# Altium project Volta-Inteface.PrjPcb
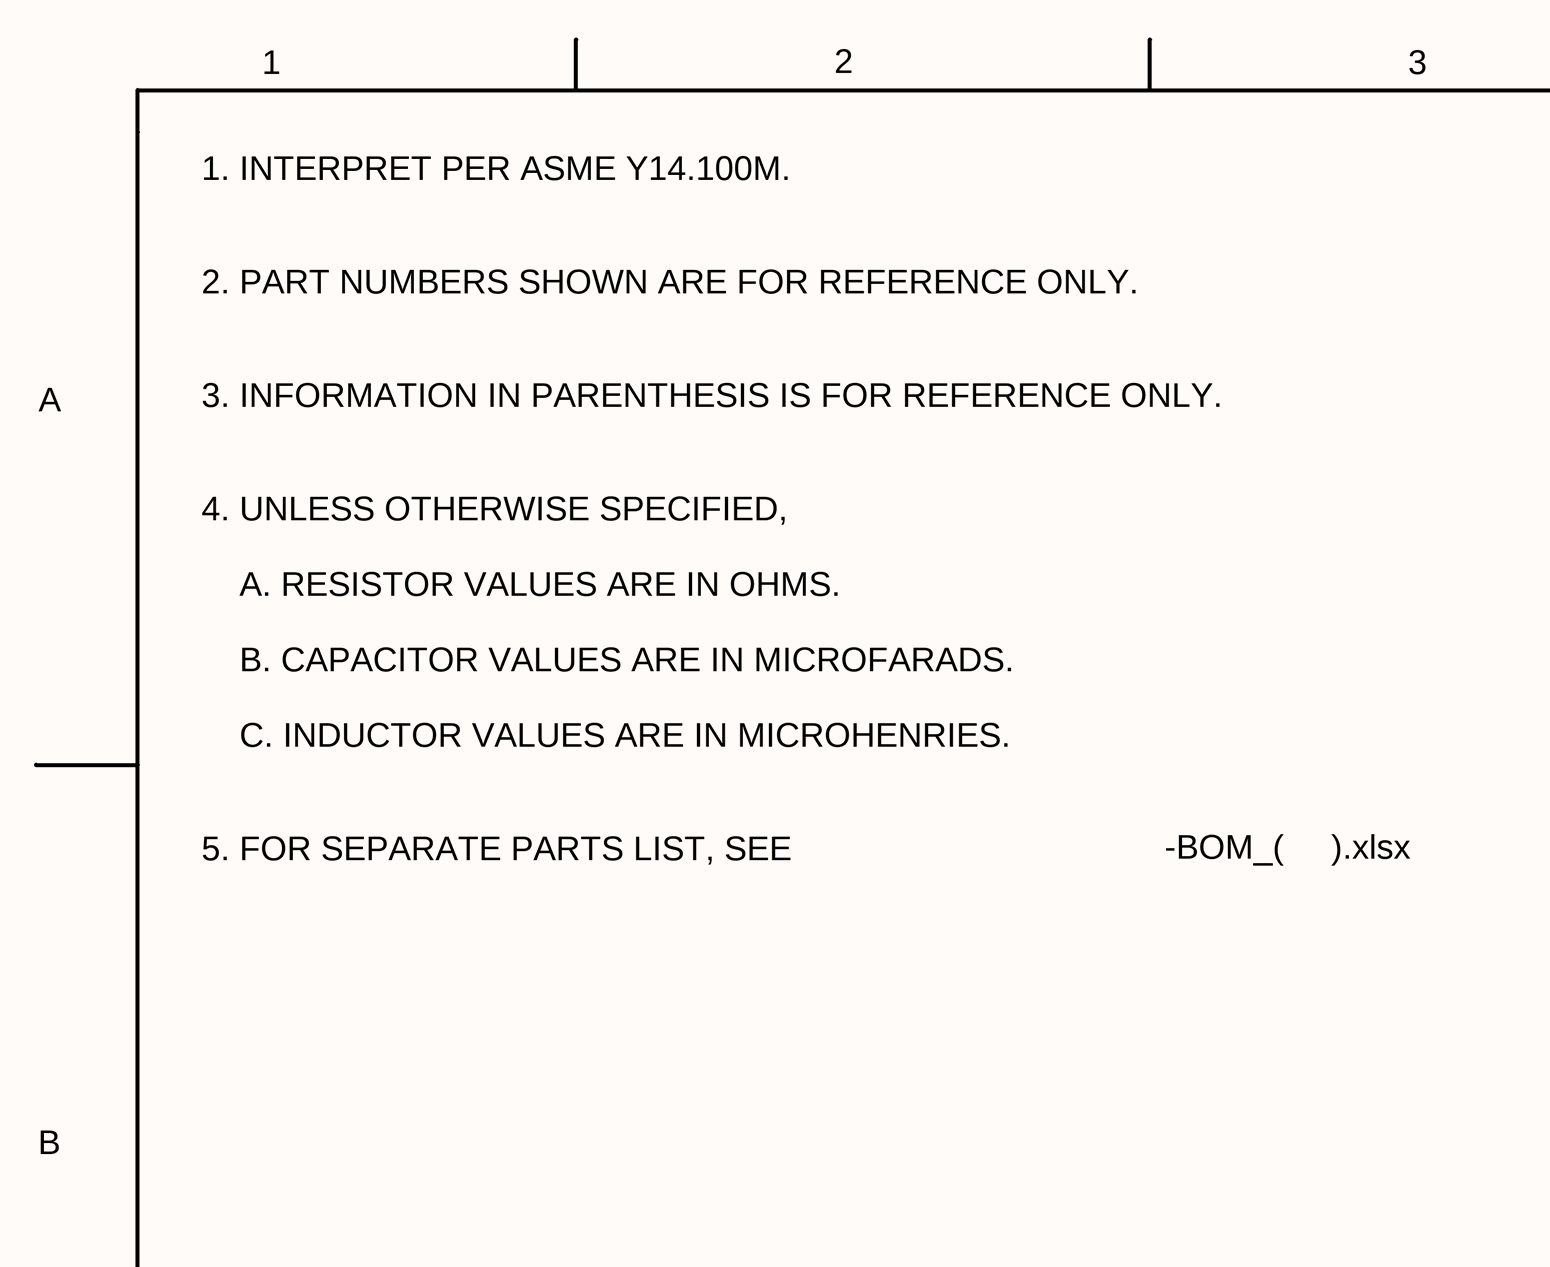
[diagram p0: Volta-Interface-SCH_SH1_(02).SchDoc, top left]
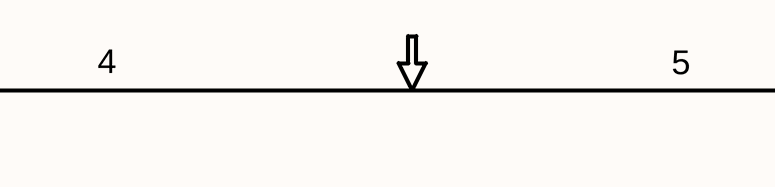
[diagram p1: Volta-Interface-SCH_SH1_(02).SchDoc, top middle]
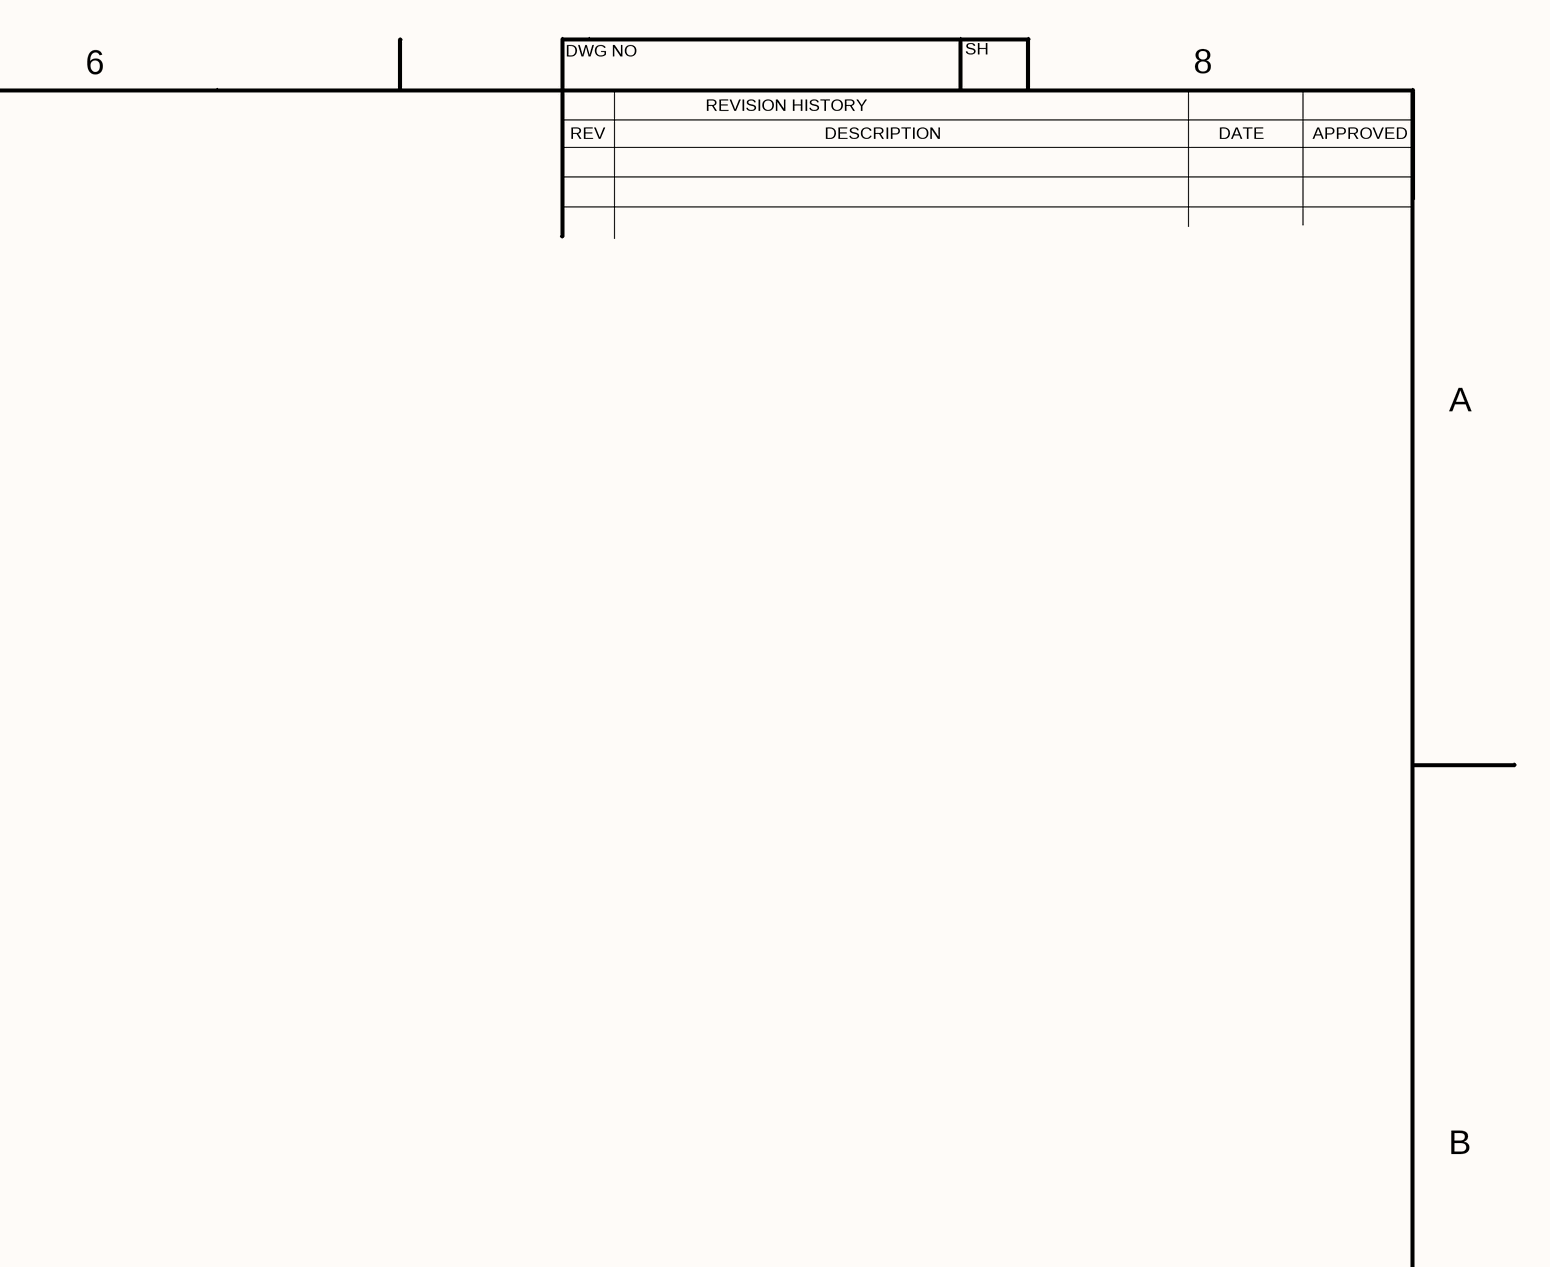
[diagram p2: Volta-Interface-SCH_SH1_(02).SchDoc, top right]
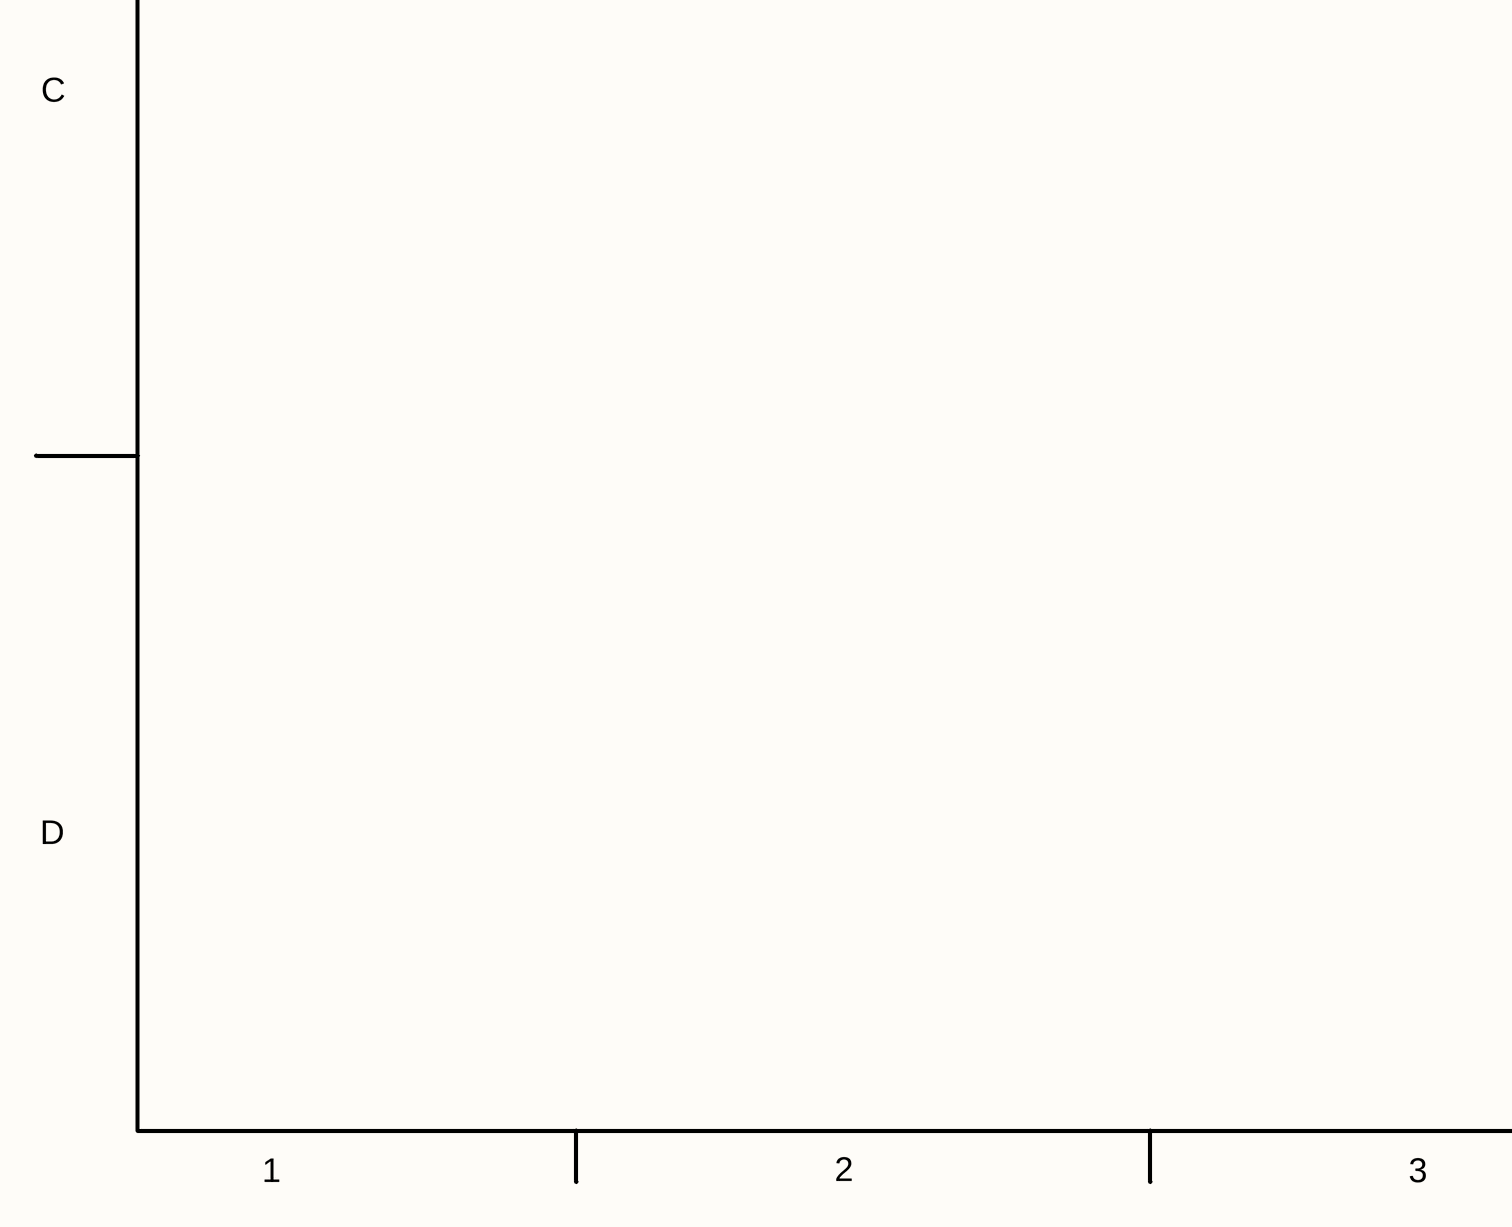
[diagram p3: Volta-Interface-SCH_SH1_(02).SchDoc, bottom left]
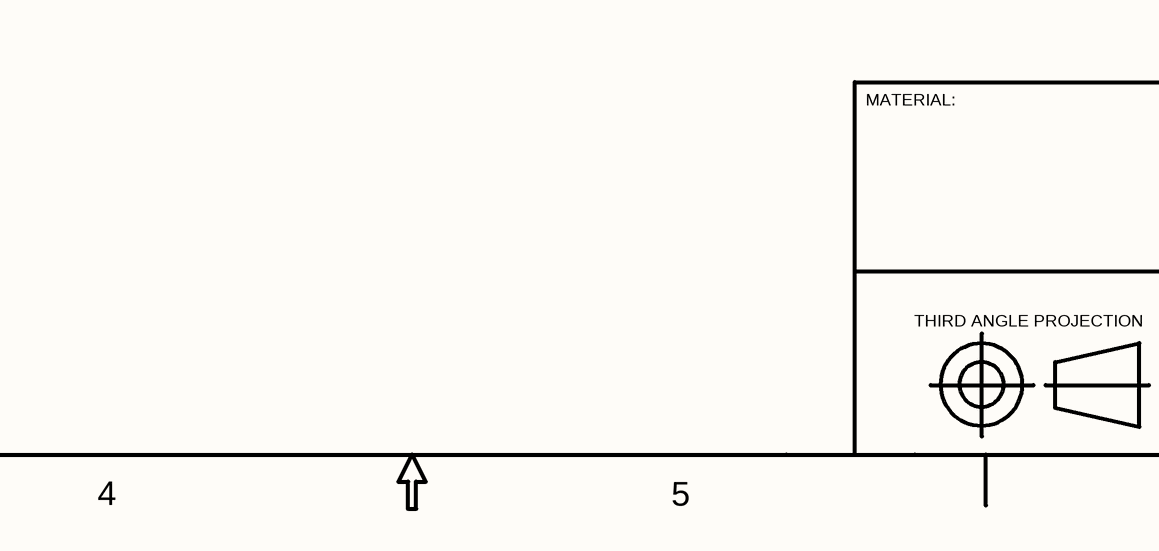
[diagram p4: Volta-Interface-SCH_SH1_(02).SchDoc, bottom middle]
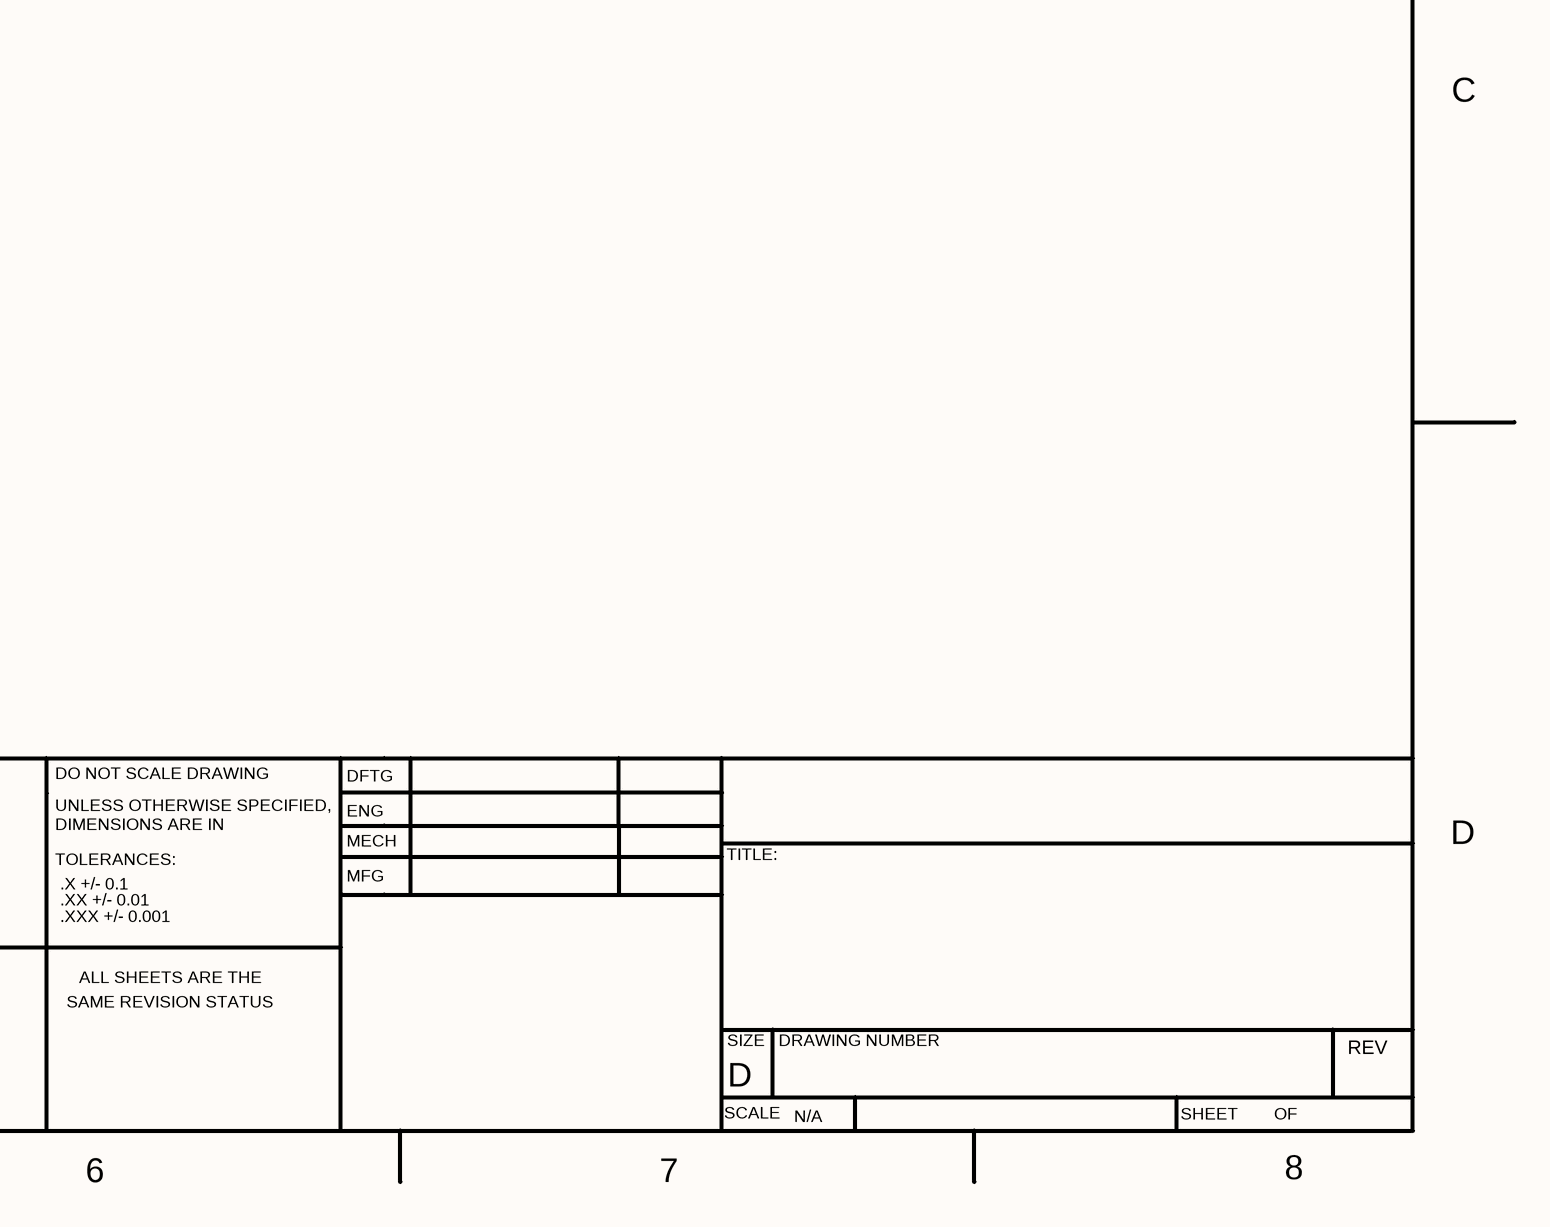
[diagram p5: Volta-Interface-SCH_SH1_(02).SchDoc, bottom right]
TitleSCH: SCHEMATIC, CCA,; TitlePCB: PRINTED CIRCUIT BOARD,; TitleCCA: CIRCUIT CARD ASSEMBLY,; Title1: Front Panel Assembly; Title0: Volta Interface; Rev: 02; NameEng: K. KIDD; NameDftg: K. KIDD; Hist3Rev: -; Hist3Desc: -; Hist3Date: -; Hist3Appr: -; Hist2Rev: -; Hist2Desc: -; Hist2Date: -; Hist2Appr: -; Hist1Rev: 01; Hist1Desc: INITIAL PROTOTYPE DESIGN; Hist1Date: 09/01/2022; Hist1Appr: -; DocNumberPCB: Volta-Inter-PCB; DocNumber: Volta-Interface; DateEng: 09/17/2022; DateDftg: 09/17/2022; Company: -
2 sheets, 49 parts. Net scope: global (net labels, ports and power ports of the same name join across sheets).
Board file: Volta-Interface.PcbDoc
Sheets:
  Volta-Interface-SCH_SH1_(02).SchDoc
  Volta-Interface-SCH_SH2_(02).SchDoc

## Sheet Volta-Interface-SCH_SH1_(02).SchDoc: SCHEMATIC, CCA,
size 863 x 558 mm; DocumentNumber: NIR-Spec-1; SheetNumber: 1; SheetTotal: 3

### Notes on the sheet
- 1
- 2
- 3
- 4
- 5
- 6
- DWG NO
- REVISION HISTORY
- SH
- 8
- REV
- DESCRIPTION
- DATE
- APPROVED
- A
- -BOM_(
- ).xlsx
- 1. INTERPRET PER ASME Y14.100M.
  2. PART NUMBERS SHOWN ARE FOR REFERENCE ONLY.
  3. INFORMATION IN PARENTHESIS IS FOR REFERENCE ONLY.
  4. UNLESS OTHERWISE SPECIFIED,
  A. RESISTOR VALUES ARE IN OHMS.
  B. CAPACITOR VALUES ARE IN MICROFARADS.
  C. INDUCTOR VALUES ARE IN MICROHENRIES.
  5. FOR SEPARATE PARTS LIST, SEE
- B
- C
- MATERIAL:
- DO NOT SCALE DRAWING
- UNLESS OTHERWISE SPECIFIED,
- ENG
- DFTG
- D
- DIMENSIONS ARE IN
- TOLERANCES:
- MECH
- MFG
- TITLE:
- .X +/- 0.1
- .XX +/- 0.01
- .XXX +/- 0.001
- THIRD ANGLE PROJECTION
- SAME REVISION STATUS
- ALL SHEETS ARE THE
- SIZE
- DRAWING NUMBER
- SCALE
- N/A
- SHEET        OF
- 7

## Sheet Volta-Interface-SCH_SH2_(02).SchDoc: SCHEMATIC
size 863 x 558 mm; DocumentNumber: NIR-Spec-2; SheetNumber: 2; SheetTotal: 3; PageSetup: Record=PageOptions|CenterHorizontal=True|CenterVertical=True|PrintScale=0.98|XCorrection=1.00|YCorrection=1.00|PrintKind=2|BorderSize=5000000|LeftOffset=0|BottomOffset=0|Orientation=2|PaperLength=1000|PaperWidth=1000|Scale=100|PaperSource=15|PrintQuality=1200|MediaType=1|DitherType=10|PaperKind=11 x 17|PrintScaleMode=1
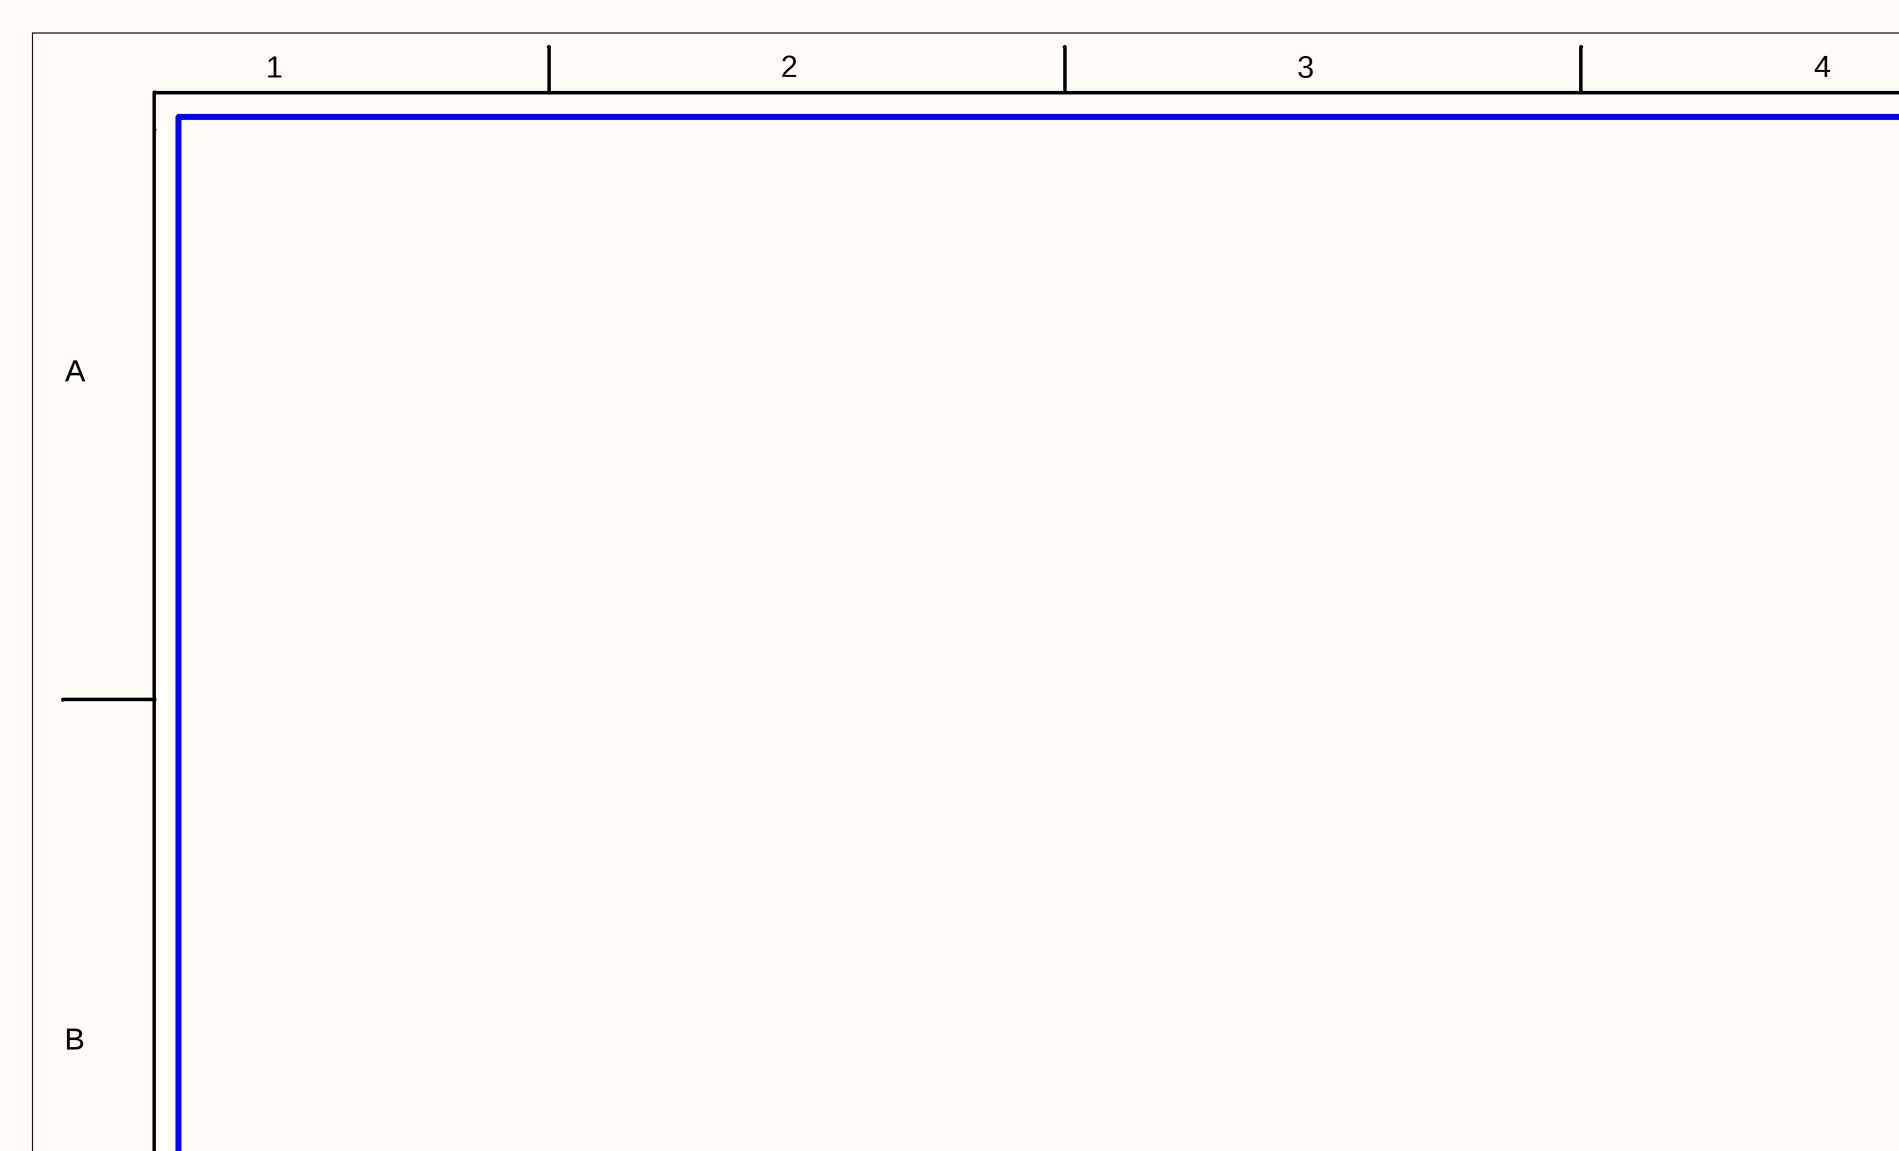
[diagram p6: Volta-Interface-SCH_SH2_(02).SchDoc, top left]
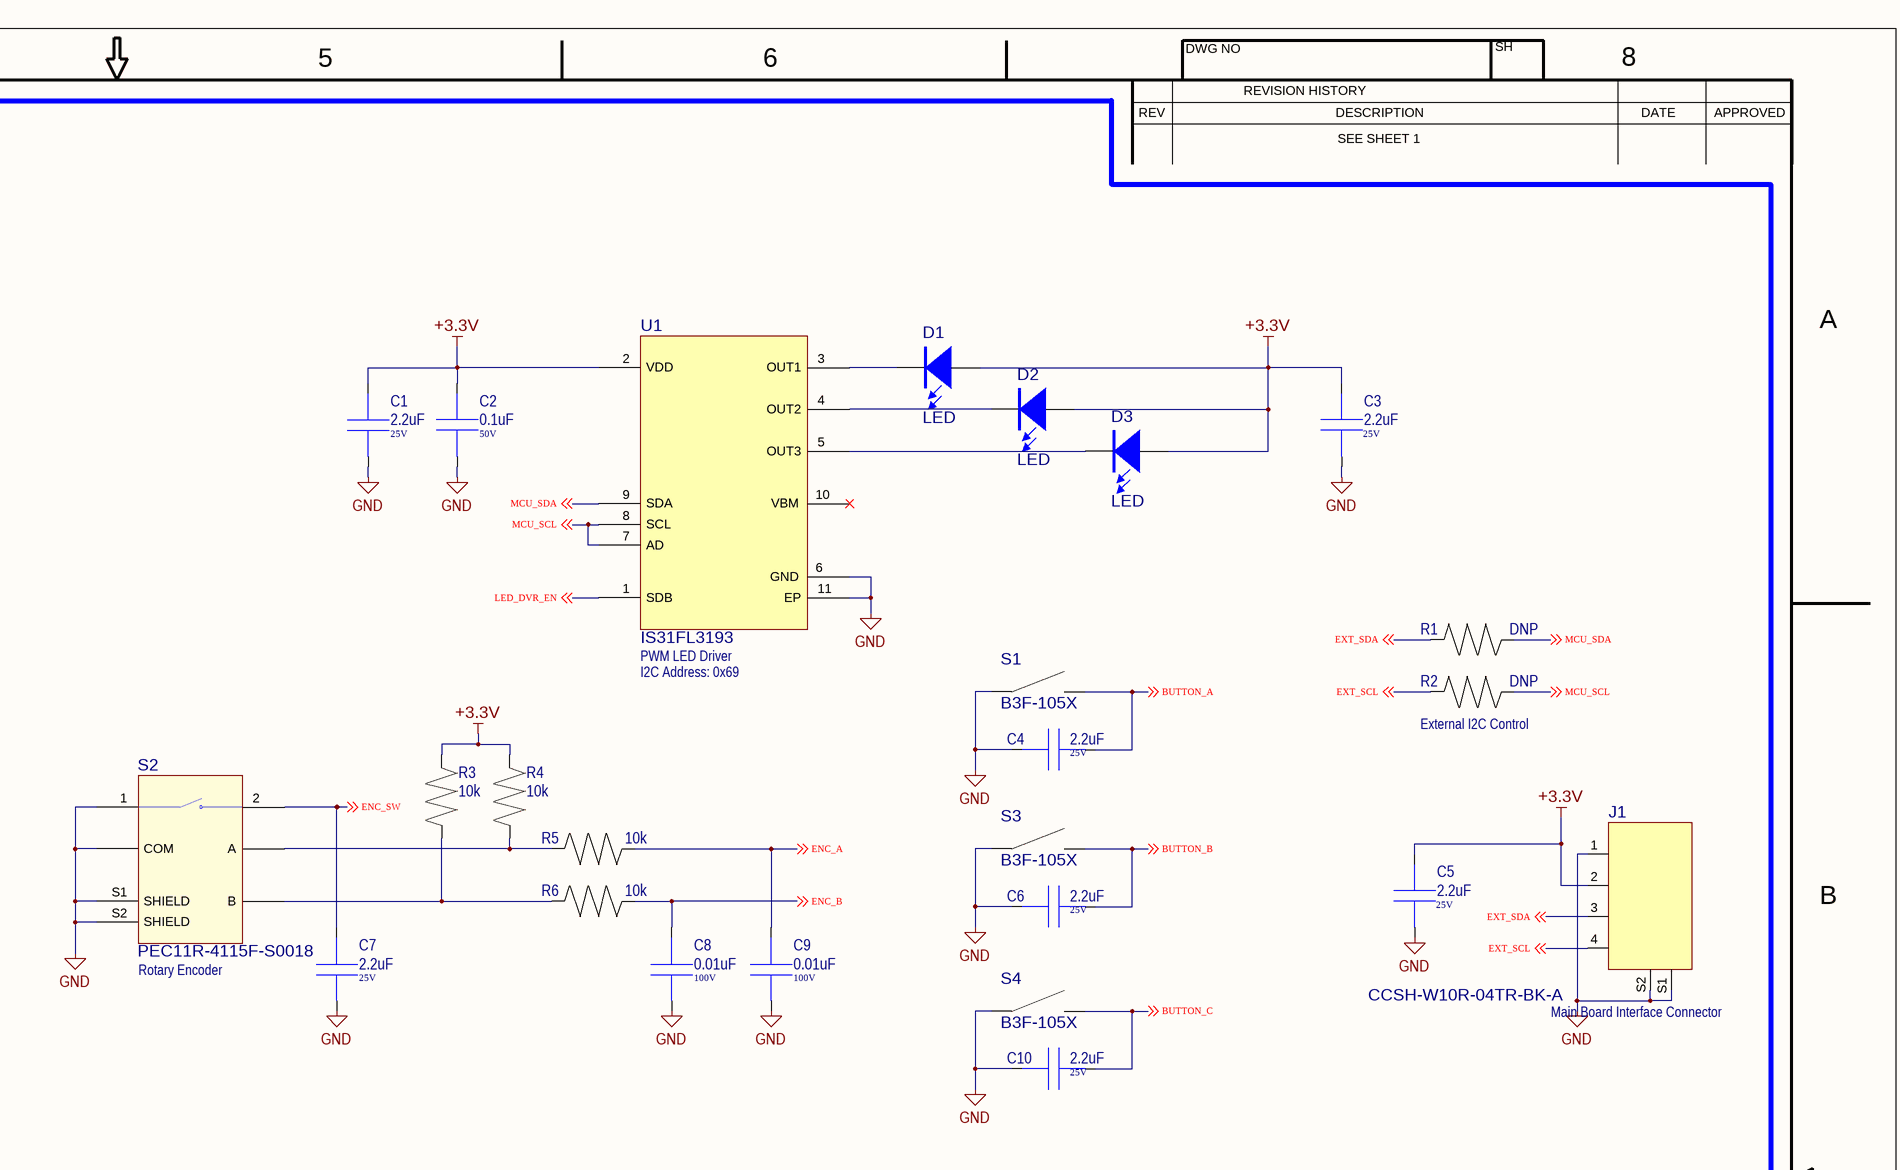
[diagram p7: Volta-Interface-SCH_SH2_(02).SchDoc, top right]
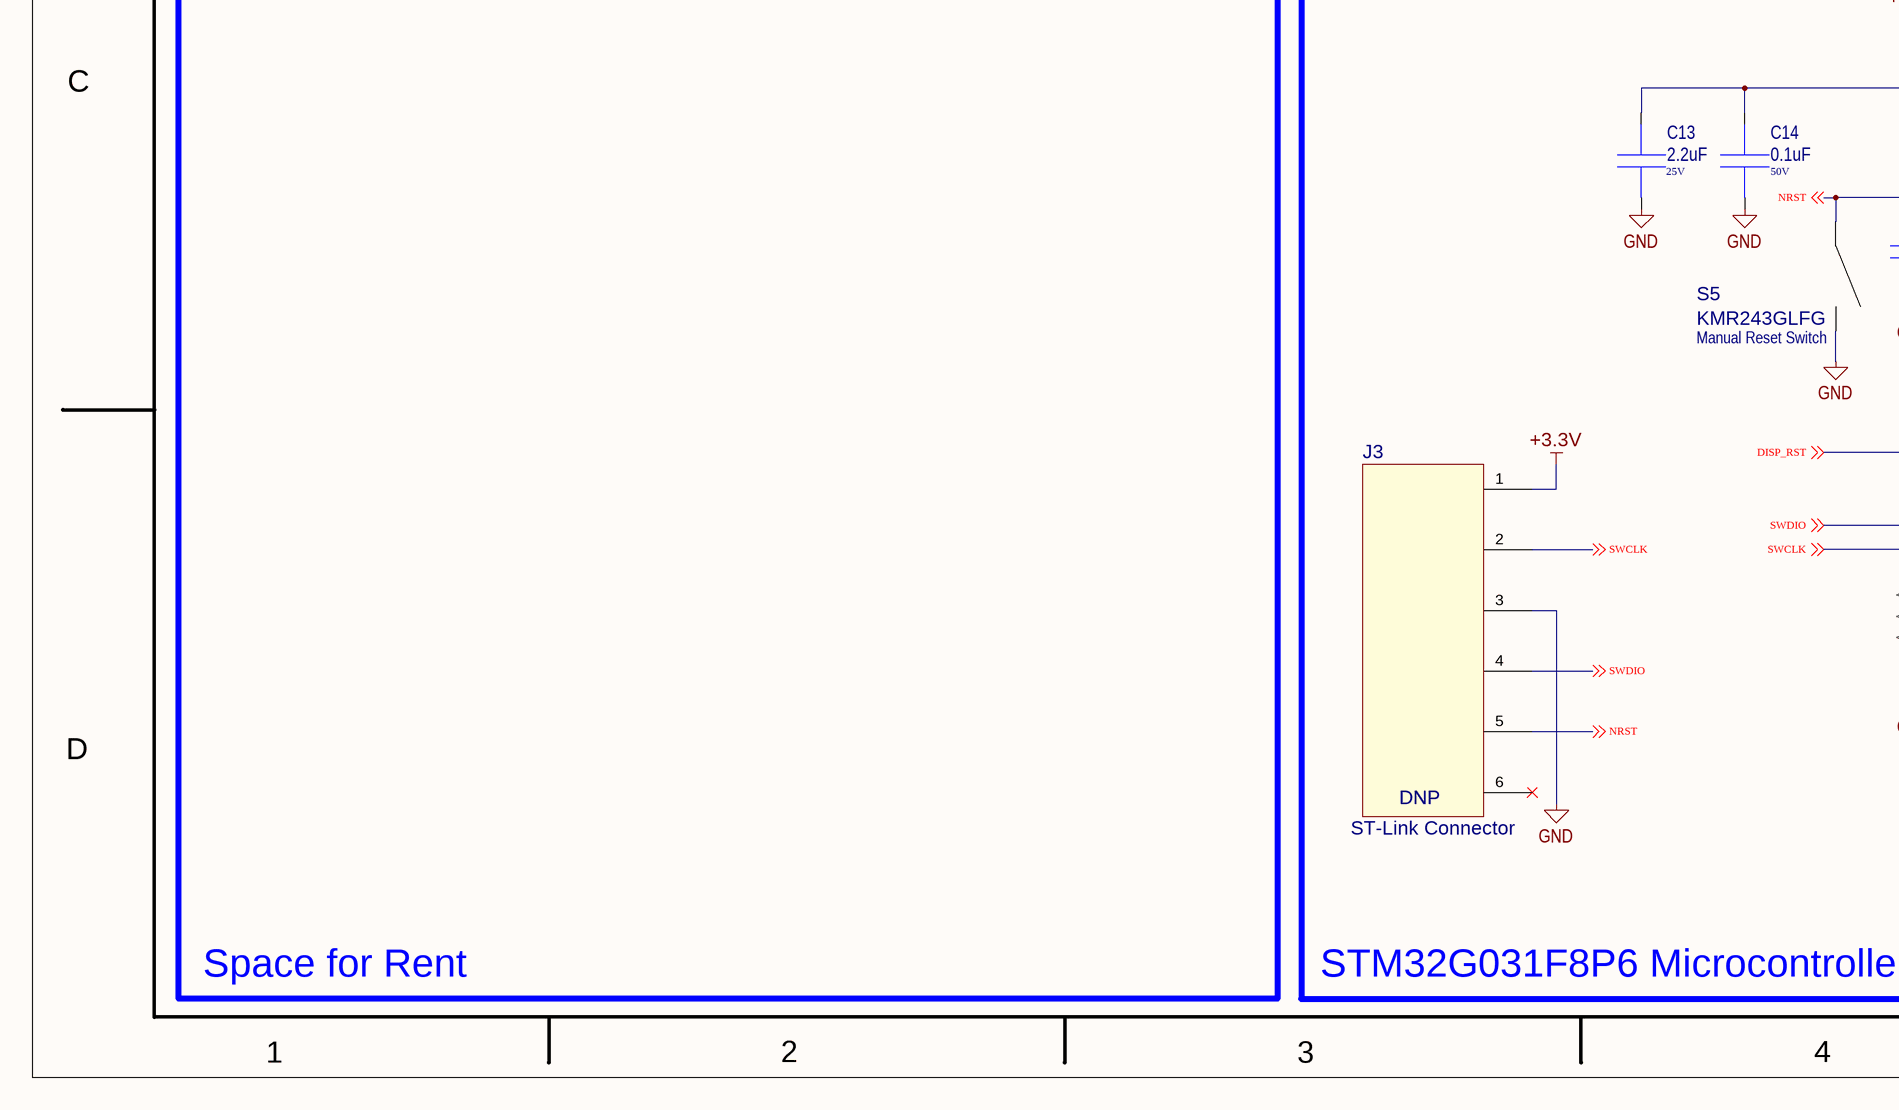
[diagram p8: Volta-Interface-SCH_SH2_(02).SchDoc, bottom left]
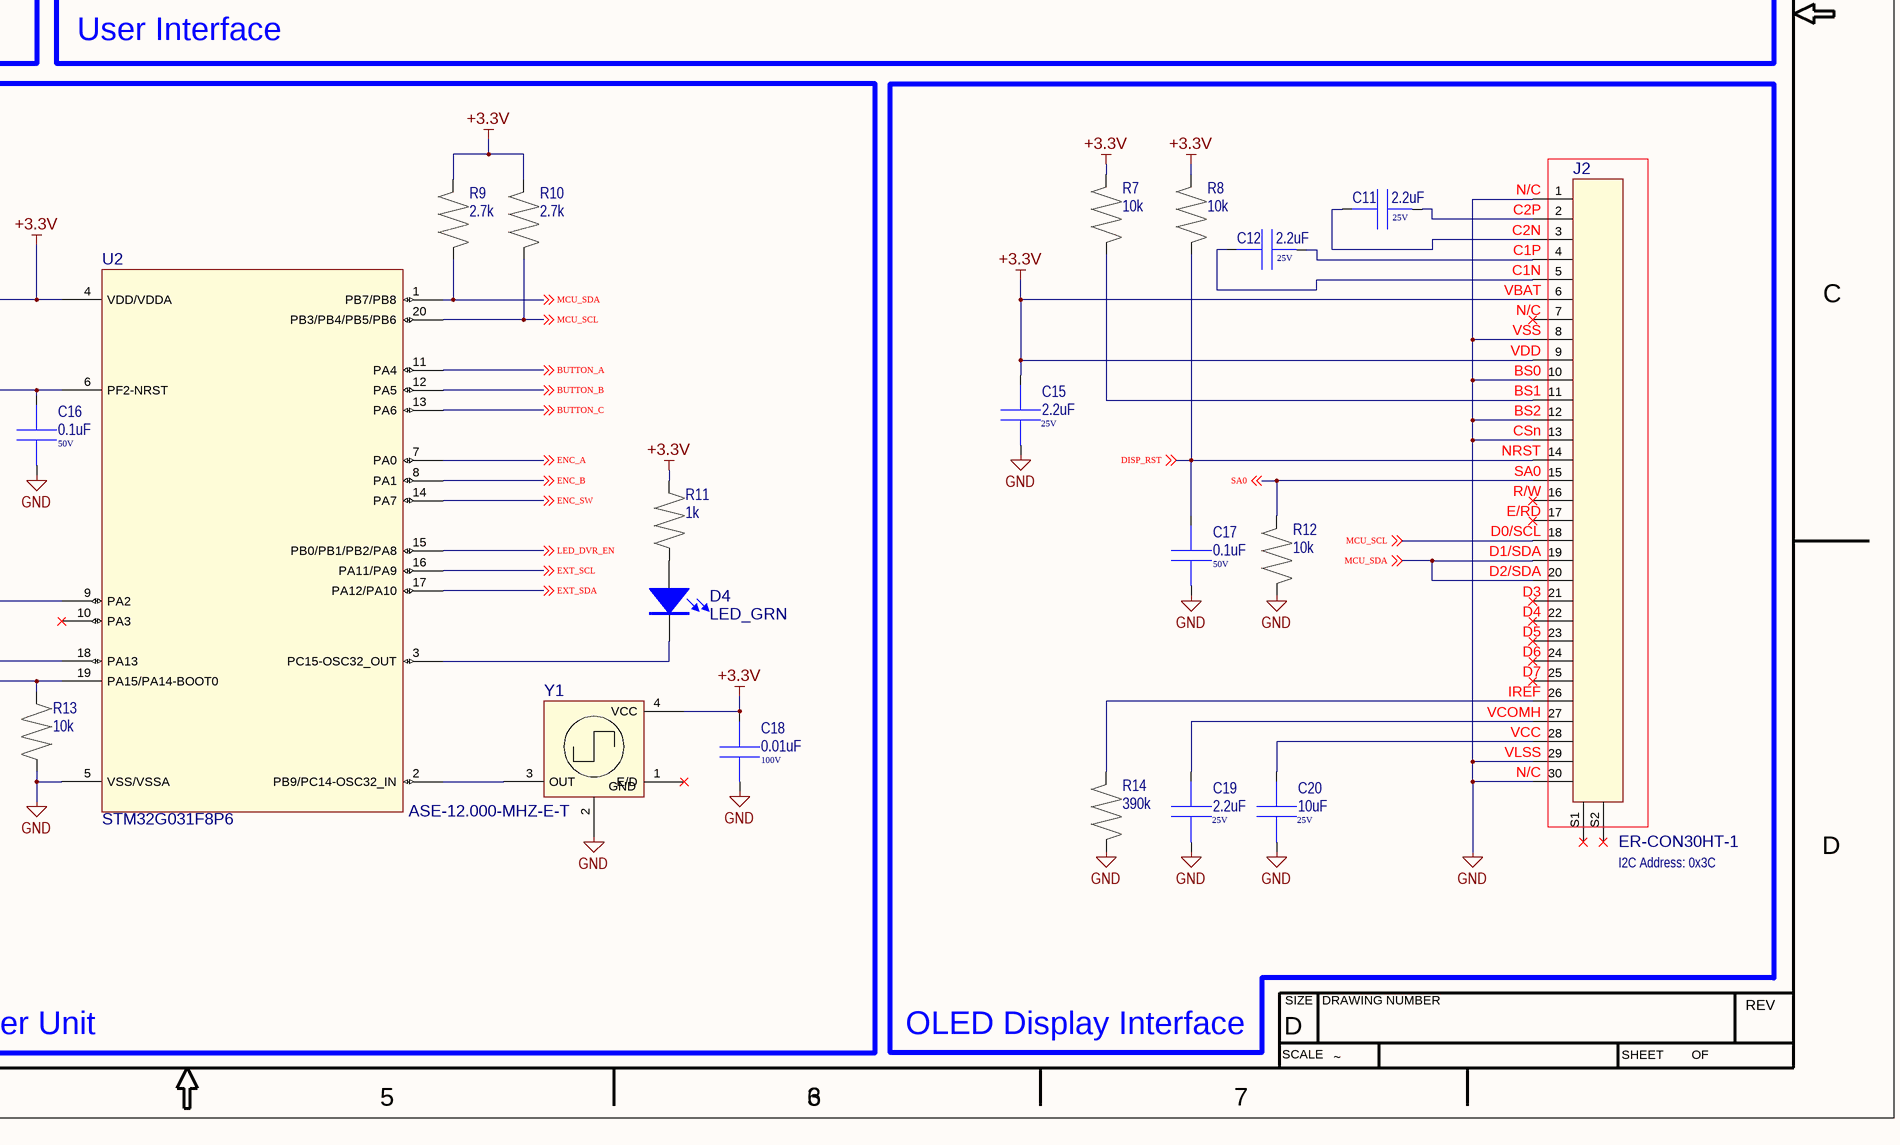
[diagram p9: Volta-Interface-SCH_SH2_(02).SchDoc, bottom right]

### Parts
C1  2.2uF  Voltage: 25V  [0402]
C2  0.1uF  Voltage: 50V  [0402]
C3  2.2uF  Voltage: 25V  [0402]
C4  2.2uF  Voltage: 25V  [0402]
C5  2.2uF  Voltage: 25V  [0402]
C6  2.2uF  Voltage: 25V  [0402]
C7  2.2uF  Voltage: 25V  [0402]
C8  0.01uF  Voltage: 100V  [0402]
C9  0.01uF  Voltage: 100V  [0402]
C10  2.2uF  Voltage: 25V  [0402]
C11  2.2uF  Voltage: 25V  [0402]
C12  2.2uF  Voltage: 25V  [0402]
C13  2.2uF  Voltage: 25V  [0402]
C14  0.1uF  Voltage: 50V  [0402]
C15  2.2uF  Voltage: 25V  [0402]
C16  0.1uF  Voltage: 50V  [0402]
C17  0.1uF  Voltage: 50V  [0402]
C18  0.01uF  Voltage: 100V  [0402]
C19  2.2uF  Voltage: 25V  [0402]
C20  10uF  Voltage: 25V  [0402]
D1  LED  [1206_LED]
D2  LED  [1206_LED]
D3  LED  [1206_LED]
D4  LED_GRN  [0603_LED_Red]
J1  CCSH-W10R-04TR-BK-A  [PCBComponent_1]
J2  ER-CON30HT-1  [ER-CON30HT-1]
J3  DNP  [801-93-006-10-012000]
R1  DNP  [0402]
R2  DNP  [0402]
R3  10k  [0402]
R4  10k  [0402]
R5  10k  [0402]
R6  10k  [0402]
R7  10k  [0402]
R8  10k  [0402]
R9  2.7k  [0402]
R10  2.7k  [0402]
R11  1k  [0402]
R12  10k  [0402]
R13  10k  [0402]
R14  390k  [0402]
S1  B3F-105X  [B3F-105X]
S2  PEC11R-4115F-S0018  [PEC11R-4xxxF-Sxxxx]
S3  B3F-105X  [B3F-105X]
S4  B3F-105X  [B3F-105X]
S5  KMR243GLFG  [KMR 2 Series]
U1  IS31FL3193  [DFN-10]
U2  STM32G031F8P6  [TSSOP-20]
Y1  ASE-12.000-MHZ-E-T  [ASE-XXXXX-X-X-X]

### Blocks framed on the sheet
User Interface: C1-C10 D1-D3 J1 R1-R6 S1-S4 U1
STM32G031F8P6 Microcontroller Unit: C13 C14 C16 C18 D4 J3 R9-R11 R13 S5 U2 Y1
OLED Display Interface: C11 C12 C15 C17 C19 C20 J2 R7 R8 R12 R14

### Nets
+3.3V: C1.2 C2.2 C3.2 C5.2 C13.2 C14.2 C15.2 C18.2 D1.1(A) D2.1(A) D3.1(A) J1.2 J2.6 J2.9 J3.1 R3.1 R4.1 R7.2 R8.2 R9.2 R10.2 R11.2 U1.2(VDD) U2.4(VDD/VDDA) Y1.4(VCC)
GND: C1.1 C2.1 C3.1 C4.2 C5.1 C6.2 C7.1 C8.1 C9.1 C10.2 C13.1 C14.1 C15.1 C16.1 C17.1 C18.1 C19.1 C20.1 J1.1 J1.S1 J1.S2 J2.1 J2.8 J2.10 J2.12 J2.13 J2.29 J2.30 J3.3 R12.1 R13.2 R14.1 S1.1 S2.1 S2.COM S2.S1(SHIELD) S2.S2(SHIELD) S3.1 S4.1 S5.2 U1.6(GND) U1.11(EP) U2.5(VSS/VSSA) Y1.2(GND)
BUTTON_A: C4.1 S1.2 U2.11(PA4) ; off-sheet BUTTON_A
BUTTON_B: C6.1 S3.2 U2.12(PA5) ; off-sheet BUTTON_B
BUTTON_C: C10.1 S4.2 U2.13(PA6) ; off-sheet BUTTON_C
DISP_RST: C17.2 J2.14 R8.1 U2.9(PA2) ; off-sheet DISP_RST
ENC_A: C9.2 R5.2 U2.7(PA0) ; off-sheet ENC_A
ENC_B: C8.2 R6.2 U2.8(PA1) ; off-sheet ENC_B
ENC_SW: C7.2 S2.2 U2.14(PA7) ; off-sheet ENC_SW
EXT_SCL: J1.4 R2.2 U2.16(PA11/PA9) ; off-sheet EXT_SCL
EXT_SDA: J1.3 R1.2 U2.17(PA12/PA10) ; off-sheet EXT_SDA
LED_DVR_EN: U1.1(SDB) U2.15(PB0/PB1/PB2/PA8) ; off-sheet LED_DVR_EN
MCU_SCL: J2.18 R2.1 R10.1 U1.7(AD) U1.8(SCL) U2.20(PB3/PB4/PB5/PB6) ; off-sheet MCU_SCL
MCU_SDA: J2.19 J2.20 R1.1 R9.1 U1.9(SDA) U2.1(PB7/PB8) ; off-sheet MCU_SDA
NRST: C16.2 J3.5 S5.1 U2.6(PF2-NRST) ; off-sheet NRST
SA0: J2.15 R12.2 ; off-sheet SA0
SWCLK: J3.2 R13.1 U2.19(PA15/PA14-BOOT0) ; off-sheet SWCLK
SWDIO: J3.4 U2.18(PA13) ; off-sheet SWDIO
NetC11_1: C11.1 J2.2
NetC11_2: C11.2 J2.3
NetC12_1: C12.1 J2.4
NetC12_2: C12.2 J2.5
NetC19_2: C19.2 J2.27
NetC20_2: C20.2 J2.28
NetD1_2: D1.2(K) U1.3(OUT1)
NetD2_2: D2.2(K) U1.4(OUT2)
NetD3_2: D3.2(K) U1.5(OUT3)
NetD4_1: D4.1(A) R11.1
NetD4_2: D4.2(K) U2.3(PC15-OSC32_OUT)
NetJ2_11: J2.11 R7.1
NetJ2_26: J2.26 R14.2
NetR3_2: R3.2 R6.1 S2.B
NetR4_2: R4.2 R5.1 S2.A
NetU2_2: U2.2(PB9/PC14-OSC32_IN) Y1.3(OUT)

Not connected (* = marked no-connect by the designer): J2 7* 16* 17* 21* 22* 23* 24* 25* S1* S2*; J3 6*; U1 10(VBM)*; U2 10(PA3)*; Y1 1(E/D)*

### Notes on the sheet
- 1
- 2
- 3
- 4
- 5
- 6
- DWG NO
- REVISION HISTORY
- SH
- 8
- REV
- DESCRIPTION
- SEE SHEET 1
- DATE
- APPROVED
- A
- I2C Address: 0x69
- PWM LED Driver
- (near R2) External I2C Control
- B
- (near S2) Rotary Encoder
- Main Board Interface Connector
- (near J2) N/C
- (near J2) C2P
- (near J2) C2N
- (near J2) C1P
- (near J2) C1N
- C
- (near J2) VBAT
- (near J2) VSS
- (near J2) VDD
- (near J2) BS0
- (near J2) BS1
- (near J2) BS2
- (near J2) CSn
- (near J2) NRST
- (near J2) SA0
- (near S5) Manual Reset Switch
- (near J2) R/W
- (near J2) E/RD
- (near J2) D0/SCL
- (near J2) D1/SDA
- (near J2) D2/SDA
- (near J2) D3
- (near J2) D4
- (near J2) D5
- (near J2) D6
- (near J2) D7
- (near J2) IREF
- (near J2) VCOMH
- (near J2) VCC
- (near J2) VLSS
- D
- I2C Address: 0x3C
- (near J3) ST-Link Connector
- Space for Rent
- SIZE
- DRAWING NUMBER
- SCALE
- ~
- SHEET        OF
- 7

### Library data of the parts
C1 C3-C7 C10 C13 = CAP: Multilayer Ceramic Capacitors MLCC - SMD/SMT 2.2UF 25V 10% 0402; Part Number: GRM155R61E225KE11D; Manufacturer: Murata Electronics; ClassName: Interface
C2 C14 C16 C17 = CAP: CAP CER 0.1UF 50V X7R 0402; Part Number: UMK105B7104KVHF; Manufacturer: Taiyo Yuden; ClassName: Interface
C8 C9 C18 = CAP: CAP CER 0.01UF 100V X7R 0402; Part Number: HMR105B7103MV-F; Manufacturer: Taiyo Yuden; ClassName: Interface
C11 C12 C15 C19 C20 = CAP: CAP CER 10UF 10V X6S 0603; Part Number: GRM188C81A106MA73D; Manufacturer: Murata Electronics; ClassName: Interface
D4 = LED_Red: Standard LEDs - SMD HE Red 645 nm Water Clear; Part Number: SM0603HCL; Manufacturer: Bivar; ClassName: Interface
J1 = CCSH-W10R-04TR-BK-A: Manufacturer: JST; Part Number: CCSH-W10R-04TR-BK-A; ClassName: Interface
J2 = ER-CON30HT-1: 30 PINS 0.5 PITCH SMD TOP CONTACT CONN; Manufacturer: EastRising Technology; Part Number: ER-CON30HT-1; ClassName: Interface
J3 = 801-93-006-10-012000: CONN SOCKET STRIP LOPRO 6POS; Manufacturer: Mill-Max; Part Number: 801-93-006-10-012000; ClassName: Interface
R1 R2 = RES: Thick Film Resistors - SMD 1/16watt 0ohm Commercial Use; Part Number: CRCW04020000Z0EDC; Manufacturer: Vishay / Dale; ClassName: Interface
R3-R6 R13 = RES: Thick Film Resistors - SMD 10K OHM 1%; Part Number: CR0402-FX-1002GLF; Manufacturer: Bourns; ClassName: Interface
R7 R8 R12 R14 = RES: Thick Film Resistors - SMD 0603 5.1Kohm 5% High Voltage; Part Number: KTR03EZPJ512; Manufacturer: ROHM Semiconductor; ClassName: Interface
R9 R10 = RES: Thick Film Resistors - SMD 0402 2.7Kohms 1% AEC-Q200; Part Number: ERJ-2RKF2701X; Manufacturer: Panasonic; ClassName: Interface
R11 = RES: Thick Film Resistors - SMD ResA 0402 1k 1% 63mW TC100; Part Number: CR0402AFX-1001GLF; Manufacturer: Bourns; ClassName: Interface
S1 S3 S4 = B3F-105X: SWITCH TACTILE SPST-NO 0.05A 24V; Manufacturer: Omron Electronics Inc-EMC Div; Part Number: B3F-105X
S2 = PEC11R-4xxxF-Sxxxx: ROTARY ENCODER MECHANICAL XXPPR; Manufacturer: Bourns; Part Number: PEC11R-4115F-S0018; ClassName: Interface
S5 = KMR 2 Series: Tactile Switch SPST-NO Top Actuated Surface Mount; Manufacturer: C&K; Part Number: KMR243GFLG; ClassName: Interface
U1 = IS31FL3193: IC LED DRIVER LINEAR 42MA 10DFN; Manufacturer: Lumissil Microsystems; Part Number: IS31FL3193-DLS2-TR; ClassName: Interface
U2 = STM32G031F6P6: IC MCU 32BIT 64KB FLASH 20TSSOP; Manufacturer: STMicroelectronics; Part Number: STM32G031F8P6; ClassName: Interface
Y1 = ASE-XXXXX-MHZ-X-X: OSC XO 12.000MHZ CMOS SMD; Manufacturer: Abracon; Part Number: ASE-12.000-MHZ-E-T; ClassName: Interface
D1-D3 = LED: Part Number: *; Manufacturer: *